# Altium project LPEDT_Assignment1_PCB.PrjPcb
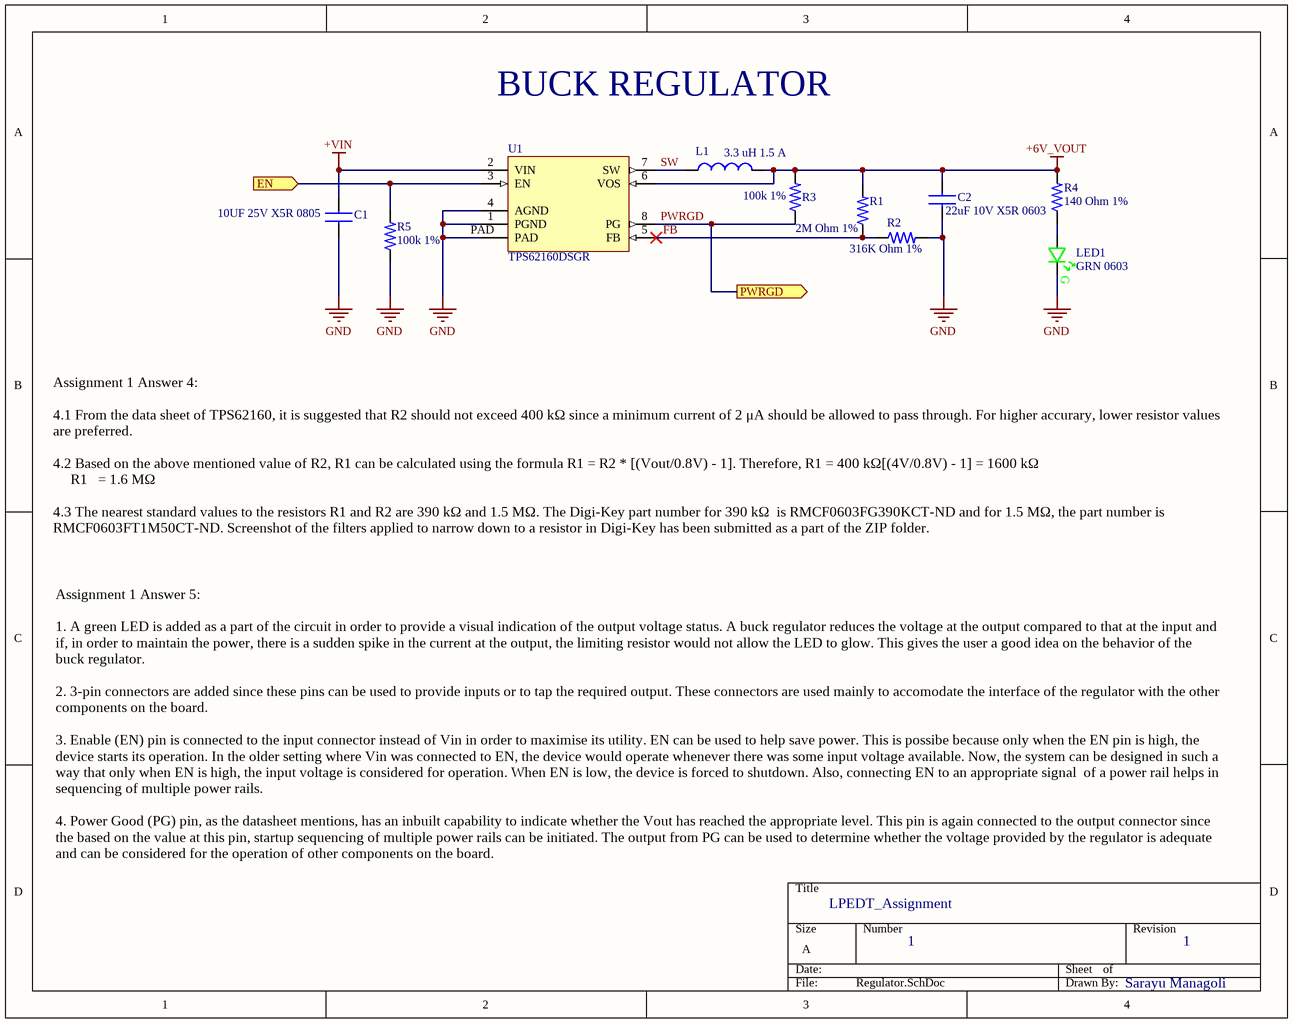
[diagram p0: Regulator.SchDoc]
2 sheets, 16 parts. Net scope: flat (ports and power ports of the same name join across sheets).
Sheets:
  Regulator.SchDoc
  Regulator_Mechanical.SchDoc

## Sheet Regulator.SchDoc: LPEDT_Assignment
size A; DocumentNumber: 1; Revision: 1; SheetNumber: 1; SheetTotal: 2

### Parts
C1  10UF 25V X5R 0805  [CAP_2012X14]
C2  22uF 10V X5R 0603  [CAP_0603_1MM]
L1  3.3 uH 1.5 A  [IND_2828x30]
LED1  GRN 0603  [LED_0603_GRN_WL-SMCW]
R1  2M Ohm 1%  [RES_0603_1608X06]
R2  316K Ohm 1%  [RES_0603_1608X06]
R3  100k 1%  [RES_0603_1608X06]
R4  140 Ohm 1%  [RES_0603_1608X06]
R5  100k 1%  [RES_0603_1608X06]
U1  TPS62160DSGR  [8-DFN_2x2]

### Ports
EN (in), PWRGD (out)

### Nets
+6V_VOUT: C2.1 L1.2 R1.2 R3.2 R4.2 U1.6(VOS)
+VIN: C1.1 U1.2(VIN)
GND: C1.2 C2.2 LED1.C R2.2 R5.1 U1.1(PGND) U1.4(AGND) U1.PAD
FB: R1.1 R2.1 U1.5(FB)
PWRGD: R3.1 U1.8(PG) ; port PWRGD
SW: L1.1 U1.7(SW)
NetH1_3: R5.2 U1.3(EN) ; port EN
NetLED1_A: LED1.A R4.1

### Notes on the sheet
- BUCK REGULATOR
- Assignment 1 Answer 4:
  4.1 From the data sheet of TPS62160, it is suggested that R2 should not exceed 400 kΩ since a minimum current of 2 μA should be allowed to pass through. For higher accurary, lower resistor values are preferred.
  4.2 Based on the above mentioned value of R2, R1 can be calculated using the formula R1 = R2 * [(Vout/0.8V) - 1]. Therefore, R1 = 400 kΩ[(4V/0.8V) - 1] = 1600 kΩ
  R1   = 1.6 MΩ
  4.3 The nearest standard values to the resistors R1 and R2 are 390 kΩ and 1.5 MΩ. The Digi-Key part number for 390 kΩ  is RMCF0603FG390KCT-ND and for 1.5 MΩ, the part number is RMCF0603FT1M50CT-ND. Screenshot of the filters applied to narrow down to a resistor in Digi-Key has been submitted as a part of the ZIP folder.
- Assignment 1 Answer 5:
  1. A green LED is added as a part of the circuit in order to provide a visual indication of the output voltage status. A buck regulator reduces the voltage at the output compared to that at the input and if, in order to maintain the power, there is a sudden spike in the current at the output, the limiting resistor would not allow the LED to glow. This gives the user a good idea on the behavior of the buck regulator.
  2. 3-pin connectors are added since these pins can be used to provide inputs or to tap the required output. These connectors are used mainly to accomodate the interface of the regulator with the other components on the board.
  3. Enable (EN) pin is connected to the input connector instead of Vin in order to maximise its utility. EN can be used to help save power. This is possibe because only when the EN pin is high, the device starts its operation. In the older setting where Vin was connected to EN, the device would operate whenever there was some input voltage available. Now, the system can be designed in such a way that only when EN is high, the input voltage is considered for operation. When EN is low, the device is forced to shutdown. Also, connecting EN to an appropriate signal  of a power rail helps in sequencing of multiple power rails.
  4. Power Good (PG) pin, as the datasheet mentions, has an inbuilt capability to indicate whether the Vout has reached the appropriate level. This pin is again connected to the output connector since the based on the value at this pin, startup sequencing of multiple power rails can be initiated. The output from PG can be used to determine whether the voltage provided by the regulator is adequate and can be considered for the operation of other components on the board.
- Sarayu Managoli
- (in symbol 150060GS75000) G

### Library data of the parts
C1 = GRM21BR61E106KA73K: CAP CER 10UF 25V X5R 0805; Manufacturer: Murata; Tolerance: 10%; Supplier 1: Digi-Key; Manufacturer Part Number: GRM21BR61E106KA73K; RoHS: Yes; Category: Ceramic Capacitors; Stock 1: 51226; Pricing 1: 1=0.25000, 10=0.17200, 50=0.10340, 100=0.08740, 500=0.05978, 1000=0.05288, 2500=0.05058, 5000=0.04598 (USD); Mount: Surface Mount; Case/Package: 0805; Weight: 0.000335oz; Min Operating Temperature: -55°C; Max Operating Temperature: 85°C; Dielectric: X5R; Voltage Rating (DC): 25V; Package Quantity: 10000; Packaging: Tape and Reel; Capacitance: 10uF; Voltage Rating: 25V; Length: 0.079inch; Width: 0.049inch; Thickness: 0.055inch; ComponentLink1URL: http://www.mouser.com/ds/2/281/c02e-2905.pdf?src-supplier=Mouser; ComponentLink1Description: http://www.mouser.com/ds/2/281/c02e-2905.pdf?src-supplier=Mouser; ComponentLink2URL: http://search.murata.co.jp/Ceramy/image/img/A01X/G101/ENG/GRM21BR61E106KA73-01.pdf?src-supplier=Digi-Key; ComponentLink2Description: http://search.murata.co.jp/Ceramy/image/img/A01X/G101/ENG/GRM21BR61E106KA73-01.pdf?src-supplier=Digi-Key; ComponentLink3URL: https://search.murata.co.jp/Ceramy/image/img/A01X/G101/ENG/GRM21BR61E106KA73-01.pdf?src-supplier=Digi-Key; ComponentLink3Description: https://search.murata.co.jp/Ceramy/image/img/A01X/G101/ENG/GRM21BR61E106KA73-01.pdf?src-supplier=Digi-Key
C2 = GRM188R61A226ME15D: CAP CER 22UF 10V X5R 0603; Manufacturer: Murata; Voltage Rating DC: 10 VDC; Tolerance: 20 %; Brand: Murata Electronics; Type: Voltage and Temperature Derating Recommended Product; Unit Weight: 0.000222 oz; Supplier 1: Digi-Key; Supplier Part Number 1: 490-10476-1-ND; Manufacturer Part Number: GRM188R61A226ME15D; Stock 1: 849458; Pricing 1: 1=0.33, 10=0.226, 50=0.1506, 100=0.1279, 500=0.0903, 1000=0.079 (USD); Product Category: Multilayer Ceramic Capacitors MLCC - SMD/SMT; RoHS: True; Capacitance: 22 uF; Dielectric: X5R; Case Code - in: 0603; Case Code - mm: 1608; Height: 0.8 mm; Maximum Operating Temperature: + 85 C; Minimum Operating Temperature: - 55 C; Product: General Type MLCCs; Series: GRM; Packaging: Reel; Length: 1.6 mm; Package / Case: 0603 (1608 metric); Factory Pack Quantity: 4000; Termination Style: SMD/SMT; Width: 0.8 mm; ComponentLink1URL: http://www.farnell.com/datasheets/2047978.pdf?src-supplier=Element14; ComponentLink1Description: http://www.farnell.com/datasheets/2047978.pdf?src-supplier=Element14
L1 = 744025003: WURTH ELEKTRONIK - 744025003 - Leistungsinduktivität (SMD), 3.3 µH, 1.5 A, Geschirmt, 1.8 A, Baureihe WE-TPC; Manufacturer: Wurth Electronics; Core Material: Ferrite; Tolerance: 20%; Current Rating: 1.5A; Saturation Current: 1.8A; Shielding: Shielded; Self Resonant Frequency: 100MHz; Inductance: 3.3uH; DC Resistance (DCR): 101mR; Test Frequency: 100kHz; Series Resistance: 85MR; Supplier 1: Digi-Key; Manufacturer Part Number: 744025003; RoHS: Yes; Category: Fixed Inductors; Stock 1: 2583; Pricing 1: 1=1.54000, 10=1.48000, 50=1.36000, 100=1.13000, 250=1.02000 (USD); Mount: Surface Mount; Case/Package: Nonstandard; Number of Pins: 2; Min Operating Temperature: -40°C; Max Operating Temperature: 125°C; Package Quantity: 1; Packaging: Cut Tape; Inductance Tolerance: 20%; Resistor Type: Wirewound; Max DC Current: 1.5A; Termination: SMD/SMT; RMS Current (Irms): 1.5A; Length: 2.8mm; Height: 2.8mm; Width: 0.11inch; Height - Seated (Max): 0.118inch; Depth: 2.8mm; REACH SVHC: Unknown; ComponentLink1URL: https://datasheet.ciiva.com/11803/0900766b80f886b5-11803594.pdf?src-supplier=RSComponents; ComponentLink1Description: https://datasheet.ciiva.com/11803/0900766b80f886b5-11803594.pdf?src-supplier=RSComponents; ComponentLink2URL: https://datasheet.ciiva.com/1060/744025003-1060566.pdf?src-supplier=Digi-Key; ComponentLink2Description: https://datasheet.ciiva.com/1060/744025003-1060566.pdf?src-supplier=Digi-Key; ComponentLink3URL: https://datasheet.ciiva.com/4954/744025003-88791-4954796.pdf?src-supplier=Mouser; ComponentLink3Description: https://datasheet.ciiva.com/4954/744025003-88791-4954796.pdf?src-supplier=Mouser; ComponentLink4URL: https://datasheet.ciiva.com/14123/744025003-eng-tds-14123829.pdf?src-supplier=Distrelec; ComponentLink4Description: https://datasheet.ciiva.com/14123/744025003-eng-tds-14123829.pdf?src-supplier=Distrelec; ComponentLink5URL: https://datasheet.ciiva.com/1060/744025003-1060567.pdf?src-supplier=Digi-Key; ComponentLink5Description: https://datasheet.ciiva.com/1060/744025003-1060567.pdf?src-supplier=Digi-Key; ComponentLink6URL: https://datasheet.ciiva.com/1060/744025003-1060568.pdf?src-supplier=Digi-Key; ComponentLink6Description: https://datasheet.ciiva.com/1060/744025003-1060568.pdf?src-supplier=Digi-Key
LED1 = 150060GS75000: LED, 0603, GREEN, 430MCD, 520NM; Manufacturer: Wurth Electronics; Dynamic Catalog: 0603 Rectangle with Flat Top Chip LEDs; 3D Model: SMCW_0603.igs / SMCW_0603.stp / SMCW_0603.wrl; Wavelength - Peak: 515nm; Voltage - Forward (Vf) (Typ): 3.2V; Current - Test: 20mA; Viewing Angle: 140°; Lens Type: Clear; Lens Style/Size: Rectangle with Flat Top, 1.1mm x 0.7mm; Other Names: 732-4971-2; Supplier 1: Digi-Key; Manufacturer Part Number: 150060GS75000; Stock 1: 34964; Pricing 1: 1=0.14, 50=0.129, 100=0.11, 500=0.095 (USD); Standard Package: 4,000; Category: Optoelectronics; Family: LED Indication - Discrete; Series: WL-SMCW; Packaging: Tape & Reel (TR); Color: Green; Wavelength - Dominant: 520nm; Millicandela Rating: 430mcd; Package / Case: 0603 (1608 Metric); Size / Dimension: 1.60mm L x 0.80mm W; Height: 0.70mm; Mounting Type: Surface Mount; Online Catalog: 0603 Rectangle with Flat Top Chip LEDs; ComponentLink1URL: https://katalog.we-online.de/led/datasheet/150060GS75000.pdf?src-supplier=Digi-Key; ComponentLink1Description: https://katalog.we-online.de/led/datasheet/150060GS75000.pdf?src-supplier=Digi-Key; ComponentLink2URL: http://www.produktinfo.conrad.com/datenblaetter/750000-774999/759427-da-01-en-CHIPLED_0603_W_KL_GRUEN_150060GS75000.pdf?src-supplier=Conrad; ComponentLink2Description: http://www.produktinfo.conrad.com/datenblaetter/750000-774999/759427-da-01-en-CHIPLED_0603_W_KL_GRUEN_150060GS75000.pdf?src-supplier=Conrad; Supplier Part Number 1: 732-4971-1-ND
R1 = RC0603FR-072ML: Res Thick Film 0603 2M Ohm 1% 0.1W(1/10W) +/-100ppm/ßC Epoxy SMD T/R; Manufacturer: Yageo; Resistance: 2MR; Power Rating: 100mW; Voltage Rating: 75V; Voltage Rating (DC): 50V; Temperature Coefficient: 100ppm/°C; Supplier 1: Digi-Key; Manufacturer Part Number: RC0603FR-072ML; RoHS: Yes; Category: Chip SMD Resistors; Stock 1: 594795; Pricing 1: 1=0.10000, 10=0.02200, 100=0.00900, 1000=0.00405, 2500=0.00352 (USD); Mount: Surface Mount; Case/Package: 0603; Weight: 7.1E-05oz; Case Code (Imperial): 0603; Case Code (Metric): 1608; Min Operating Temperature: -55°C; Max Operating Temperature: 155°C; Tolerance: 1%; Packaging: Tape and Reel; Package Quantity: 1; Max Power Dissipation: 100mW; Features: Moisture Resistant; Termination: SMD/SMT; Resistor Type: Thick Film; Number of Terminations: 2; Length: 1.6mm; Height: 0.45mm; Width: 0.8mm; Depth: 0.8mm; Lead Free: Lead Free; ComponentLink1URL: https://datasheet.ciiva.com/11808/0900766b80f96399-11808743.pdf?src-supplier=RSComponents; ComponentLink1Description: https://datasheet.ciiva.com/11808/0900766b80f96399-11808743.pdf?src-supplier=RSComponents; ComponentLink2URL: https://datasheet.ciiva.com/2454/pyu-r-int-thick-7-2454115.pdf?src-supplier=Digi-Key; ComponentLink2Description: https://datasheet.ciiva.com/2454/pyu-r-int-thick-7-2454115.pdf?src-supplier=Digi-Key; ComponentLink3URL: https://datasheet.ciiva.com/2454/pyu-r-int-thick-7-2454116.pdf?src-supplier=Digi-Key; ComponentLink3Description: https://datasheet.ciiva.com/2454/pyu-r-int-thick-7-2454116.pdf?src-supplier=Digi-Key; ComponentLink4URL: https://datasheet.ciiva.com/2454/pyu-r-int-thick-7-2454114.pdf?src-supplier=Digi-Key; ComponentLink4Description: https://datasheet.ciiva.com/2454/pyu-r-int-thick-7-2454114.pdf?src-supplier=Digi-Key
R2 = RC0603FR-0731K6L: Res Thick Film 0603 31.6K Ohm 1% 0.1W(1/10W) ?100ppm/?C Molded SMD Paper T/R; Manufacturer: Yageo; Power Rating: 100mW; Resistance: 31.6kR; Temperature Coefficient: 100ppm/°C; Voltage Rating (DC): 50V; Working Voltage: 75V; Supplier 1: Digi-Key; Manufacturer Part Number: RC0603FR-0731K6L; RoHS: Yes; Category: Chip SMD Resistors; Stock 1: 121296; Pricing 1: 1=0.10000, 10=0.02200, 100=0.00900, 1000=0.00405, 2500=0.00352 (USD); Case/Package: 0603; Case Code (Imperial): 0603; Case Code (Metric): 1608; Min Operating Temperature: -55°C; Max Operating Temperature: 155°C; Packaging: Tape and Reel; Tolerance: 1%; Package Quantity: 1; Voltage Rating: 50V; Termination: SMD/SMT; Resistor Type: Thick Film; Number of Terminations: 2; Max Power Dissipation: 100mW; Features: Moisture Resistant; Length: 1.6mm; Height: 0.022inch; Width: 0.8mm; Depth: 0.8mm; Lead Free: Lead Free; Military Standard: Not; ComponentLink1URL: https://datasheet.ciiva.com/15189/getdatasheetpartid-687536-15189700.pdf?src-supplier=Verical; ComponentLink1Description: https://datasheet.ciiva.com/15189/getdatasheetpartid-687536-15189700.pdf?src-supplier=Verical; ComponentLink2URL: https://datasheet.ciiva.com/2455/pyu-r-int-thick-7-2455125.pdf?src-supplier=Digi-Key; ComponentLink2Description: https://datasheet.ciiva.com/2455/pyu-r-int-thick-7-2455125.pdf?src-supplier=Digi-Key; ComponentLink3URL: https://datasheet.ciiva.com/15189/getdatasheetpartid-329296-15189701.pdf?src-supplier=Verical; ComponentLink3Description: https://datasheet.ciiva.com/15189/getdatasheetpartid-329296-15189701.pdf?src-supplier=Verical; ComponentLink4URL: https://datasheet.ciiva.com/2455/pyu-r-int-thick-7-2455126.pdf?src-supplier=Digi-Key; ComponentLink4Description: https://datasheet.ciiva.com/2455/pyu-r-int-thick-7-2455126.pdf?src-supplier=Digi-Key; ComponentLink5URL: https://datasheet.ciiva.com/2455/pyu-r-int-thick-7-2455127.pdf?src-supplier=Digi-Key; ComponentLink5Description: https://datasheet.ciiva.com/2455/pyu-r-int-thick-7-2455127.pdf?src-supplier=Digi-Key
R3 R5 = RC0603FR-07100KL: RES SMD 100K OHM 1% 1/10W 0603; Manufacturer: Yageo; Resistance: 100 kOhms; Power Rating: 100 mW; Voltage Rating: 50 V; Temperature Coefficient: 100 PPM / C; Supplier 1: Digi-Key; Supplier Part Number 1: 311-100KHRCT-ND; Manufacturer Part Number: RC0603FR-07100KL; Stock 1: 13478446; Pricing 1: 1=0.1, 10=0.022, 100=0.009, 1000=0.0041, 2500=0.0035 (USD); Termination Style: SMD/SMT; Product: Thick Film Resistors General Purpose; Tolerance: 1 %; Case Code - in: 0603; Case Code - mm: 1608; Series: RC; Operating Temperature Range: - 55 C to + 155 C; Packaging: Reel; ComponentLink1URL: http://www.farnell.com/datasheets/2167052.pdf?src-supplier=Element14; ComponentLink1Description: http://www.farnell.com/datasheets/2167052.pdf?src-supplier=Element14; ComponentLink2URL: http://www.farnell.com/datasheets/1868787.pdf?src-supplier=Element14; ComponentLink2Description: http://www.farnell.com/datasheets/1868787.pdf?src-supplier=Element14; ComponentLink3URL: http://documents.rs-components.com/techlib://itc_doclist_GB.htm?stockno=5048940&src-supplier=RSComponents; ComponentLink3Description: http://documents.rs-components.com/techlib://itc_doclist_GB.htm?stockno=5048940&src-supplier=RSComponents; ComponentLink4URL: http://www.farnell.com/datasheets/443971.pdf?src-supplier=Element14; ComponentLink4Description: http://www.farnell.com/datasheets/443971.pdf?src-supplier=Element14
R4 = RC0603FR-07140RL: Thick Film Resistors 140 OHM 1%; Manufacturer: Yageo; Resistance: 140R; Power Rating: 100mW; Voltage Rating: 50V; Temperature Coefficient: 100ppm/°C; Supplier 1: Digi-Key; Manufacturer Part Number: RC0603FR-07140RL; RoHS: Yes; Category: Chip SMD Resistors; Stock 1: 606987; Pricing 1: 1=0.10000, 10=0.02200, 100=0.00900, 1000=0.00405, 2500=0.00352 (USD); Mount: Surface Mount; Case/Package: 0603; Case Code (Imperial): 0603; Case Code (Metric): 1608; Min Operating Temperature: -55°C; Max Operating Temperature: 155°C; Tolerance: 1%; Packaging: Tape and Reel; Termination: SMD/SMT; Resistor Type: Thick Film; Voltage Rating (DC): 50V; Length: 1.6mm; Height: 0.45mm; Depth: 0.8mm; Military Standard: Not; Lead Free: Lead Free; ComponentLink1URL: https://datasheet.ciiva.com/11808/0900766b80c66297-11808828.pdf?src-supplier=RSComponents; ComponentLink1Description: https://datasheet.ciiva.com/11808/0900766b80c66297-11808828.pdf?src-supplier=RSComponents; ComponentLink2URL: https://datasheet.ciiva.com/15189/getdatasheetpartid-329205-15189606.pdf?src-supplier=Verical; ComponentLink2Description: https://datasheet.ciiva.com/15189/getdatasheetpartid-329205-15189606.pdf?src-supplier=Verical
U1 = TPS62160DSGR: IC REG BUCK ADJ 1A SYNC 8WSON; Manufacturer: Texas Instruments; Number of Outputs: 1; Output Voltage: 6V; Max Input Voltage: 17V; Min Input Voltage: 3V; Min Output Voltage: 900mV; Switching Frequency: 2.25MHz; Synchronous Rectifier: Yes; Quiescent Current: 17uA; Output Type: Adjustable; Output Configuration: Positive; Supplier 1: Digi-Key; Manufacturer Part Number: TPS62160DSGR; RoHS: Yes; Category: Voltage Regulators - Switching; Stock 1: 51561; Pricing 1: 1=1.59000, 10=1.43100, 25=1.35000, 100=1.08000, 250=0.94500, 500=0.91800, 1000=0.72900 (USD); Case/Package: SOIC; Number of Pins: 8; Contact Plating: Gold; Min Operating Temperature: -40°C; Max Operating Temperature: 125°C; Packaging: Tape and Reel; Package Quantity: 3000; Output Current: 1A; Max Output Current: 1A; Max Output Voltage: 6V; Operating Supply Voltage: 17V; Radiation Hardening: No; REACH SVHC: No SVHC; Lead Free: Lead Free; ComponentLink1URL: https://datasheet.ciiva.com/2026/tps62161-2026049.pdf?src-supplier=Digi-Key; ComponentLink1Description: https://datasheet.ciiva.com/2026/tps62161-2026049.pdf?src-supplier=Digi-Key; ComponentLink2URL: https://datasheet.ciiva.com/2026/tps62160-2026414.pdf?src-supplier=Digi-Key; ComponentLink2Description: https://datasheet.ciiva.com/2026/tps62160-2026414.pdf?src-supplier=Digi-Key; ComponentLink3URL: https://datasheet.ciiva.com/2026/tps62160-2026415.pdf?src-supplier=Digi-Key; ComponentLink3Description: https://datasheet.ciiva.com/2026/tps62160-2026415.pdf?src-supplier=Digi-Key

## Sheet Regulator_Mechanical.SchDoc: LPEDT_Assignment
size A; DocumentNumber: 1; Revision: 1; SheetNumber: 2; SheetTotal: 2
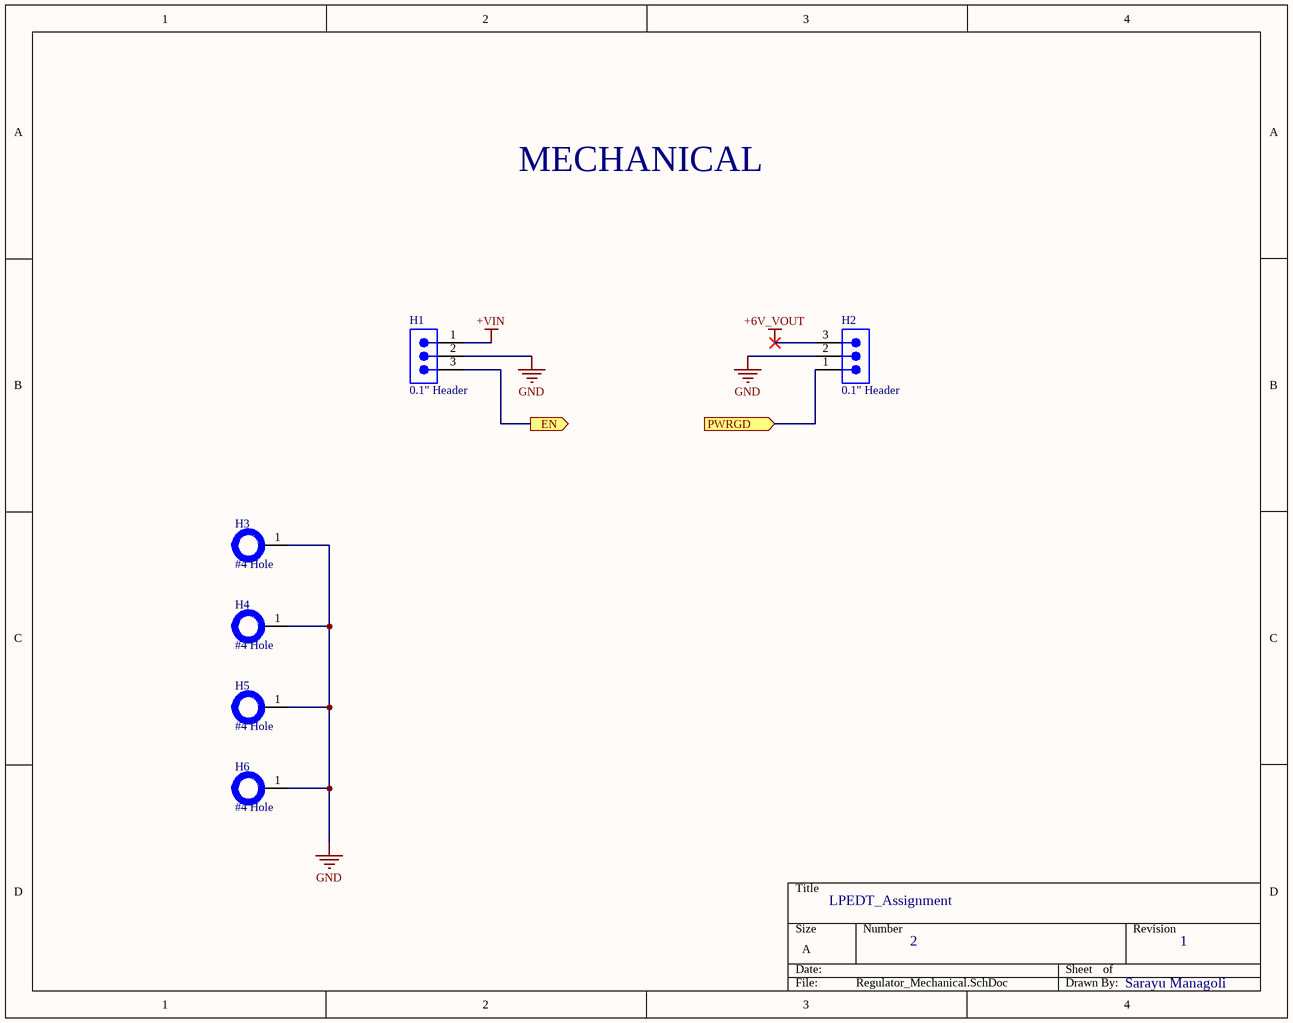
[diagram p1: Regulator_Mechanical.SchDoc]

### Parts
H1  0.1" Header  [3-PIN_MALE_HEADER_01-IN]
H2  0.1" Header  [3-PIN_MALE_HEADER_01-IN]
H3  #4 Hole  [HOLE_#4]  (no BOM)
H4  #4 Hole  [HOLE_#4]  (no BOM)
H5  #4 Hole  [HOLE_#4]  (no BOM)
H6  #4 Hole  [HOLE_#4]  (no BOM)

### Ports
EN (out), PWRGD (in)

### Nets
+6V_VOUT: H2.3
+VIN: H1.1
GND: H1.2 H2.2 H3.1 H4.1 H5.1 H6.1
PWRGD: H2.1 ; port PWRGD
NetH1_3: H1.3 ; port EN

### Notes on the sheet
- MECHANICAL
- Sarayu Managoli

### Library data of the parts
H1 H2 = PRPC003SAAN-RC: CONN HEADER VERT 3POS 2.54MM; Manufacturer: Sullins; Connector Type: Header, Unshrouded, Breakaway; Number of Positions: 3; Number of Positions Loaded: All; Pitch: 0.100" (2.54mm); Online Catalog: 0.100" (2.54mm) Pitch Connector Headers; Other Names: S9510E-03  S9510E-03-ND; Supplier 1: Digi-Key; Manufacturer Part Number: PRPC003SAAN-RC; Stock 1: 19067; Pricing 1: 1=0.12, 10=0.109, 25=0.0812, 50=0.0696, 100=0.0673, 250=0.058, 500=0.0557 (USD); Standard Package: 1; Category: Connectors, Interconnects; Family: Rectangular Connectors - Headers, Male Pins; Series: -; Packaging: Bulk; Contact Type: Male Pin; Number of Rows: 1; Row Spacing: -; Contact Mating Length: 0.230" (5.84mm); Mounting Type: Through Hole; Termination: Solder; Fastening Type: -; Features: -; Contact Finish: Gold; Contact Finish Thickness: Flash; Color: Black; ComponentLink1URL: https://media.digikey.com/PDF/Data%20Sheets/Sullins%20PDFs/xRxCzzzSxxN-RC_ST_11635-B.pdf?src-supplier=Digi-Key; ComponentLink1Description: https://media.digikey.com/PDF/Data%20Sheets/Sullins%20PDFs/xRxCzzzSxxN-RC_ST_11635-B.pdf?src-supplier=Digi-Key; Supplier Part Number 1: S1011EC-03-ND
H3-H6 = HOLE_#4

## Nets that join several sheets
+6V_VOUT: Regulator (6 pins), Regulator_Mechanical (H2.3)
+VIN: Regulator (C1.1 U1.2), Regulator_Mechanical (H1.1)
GND: Regulator (8 pins), Regulator_Mechanical (6 pins)
NetH1_3: Regulator (R5.2 U1.3), Regulator_Mechanical (H1.3)
PWRGD: Regulator (R3.1 U1.8), Regulator_Mechanical (H2.1)